# EAGLE design labwiz-module_full_breakout (EAGLE 6.5.0)

## Sheet 1 of 2
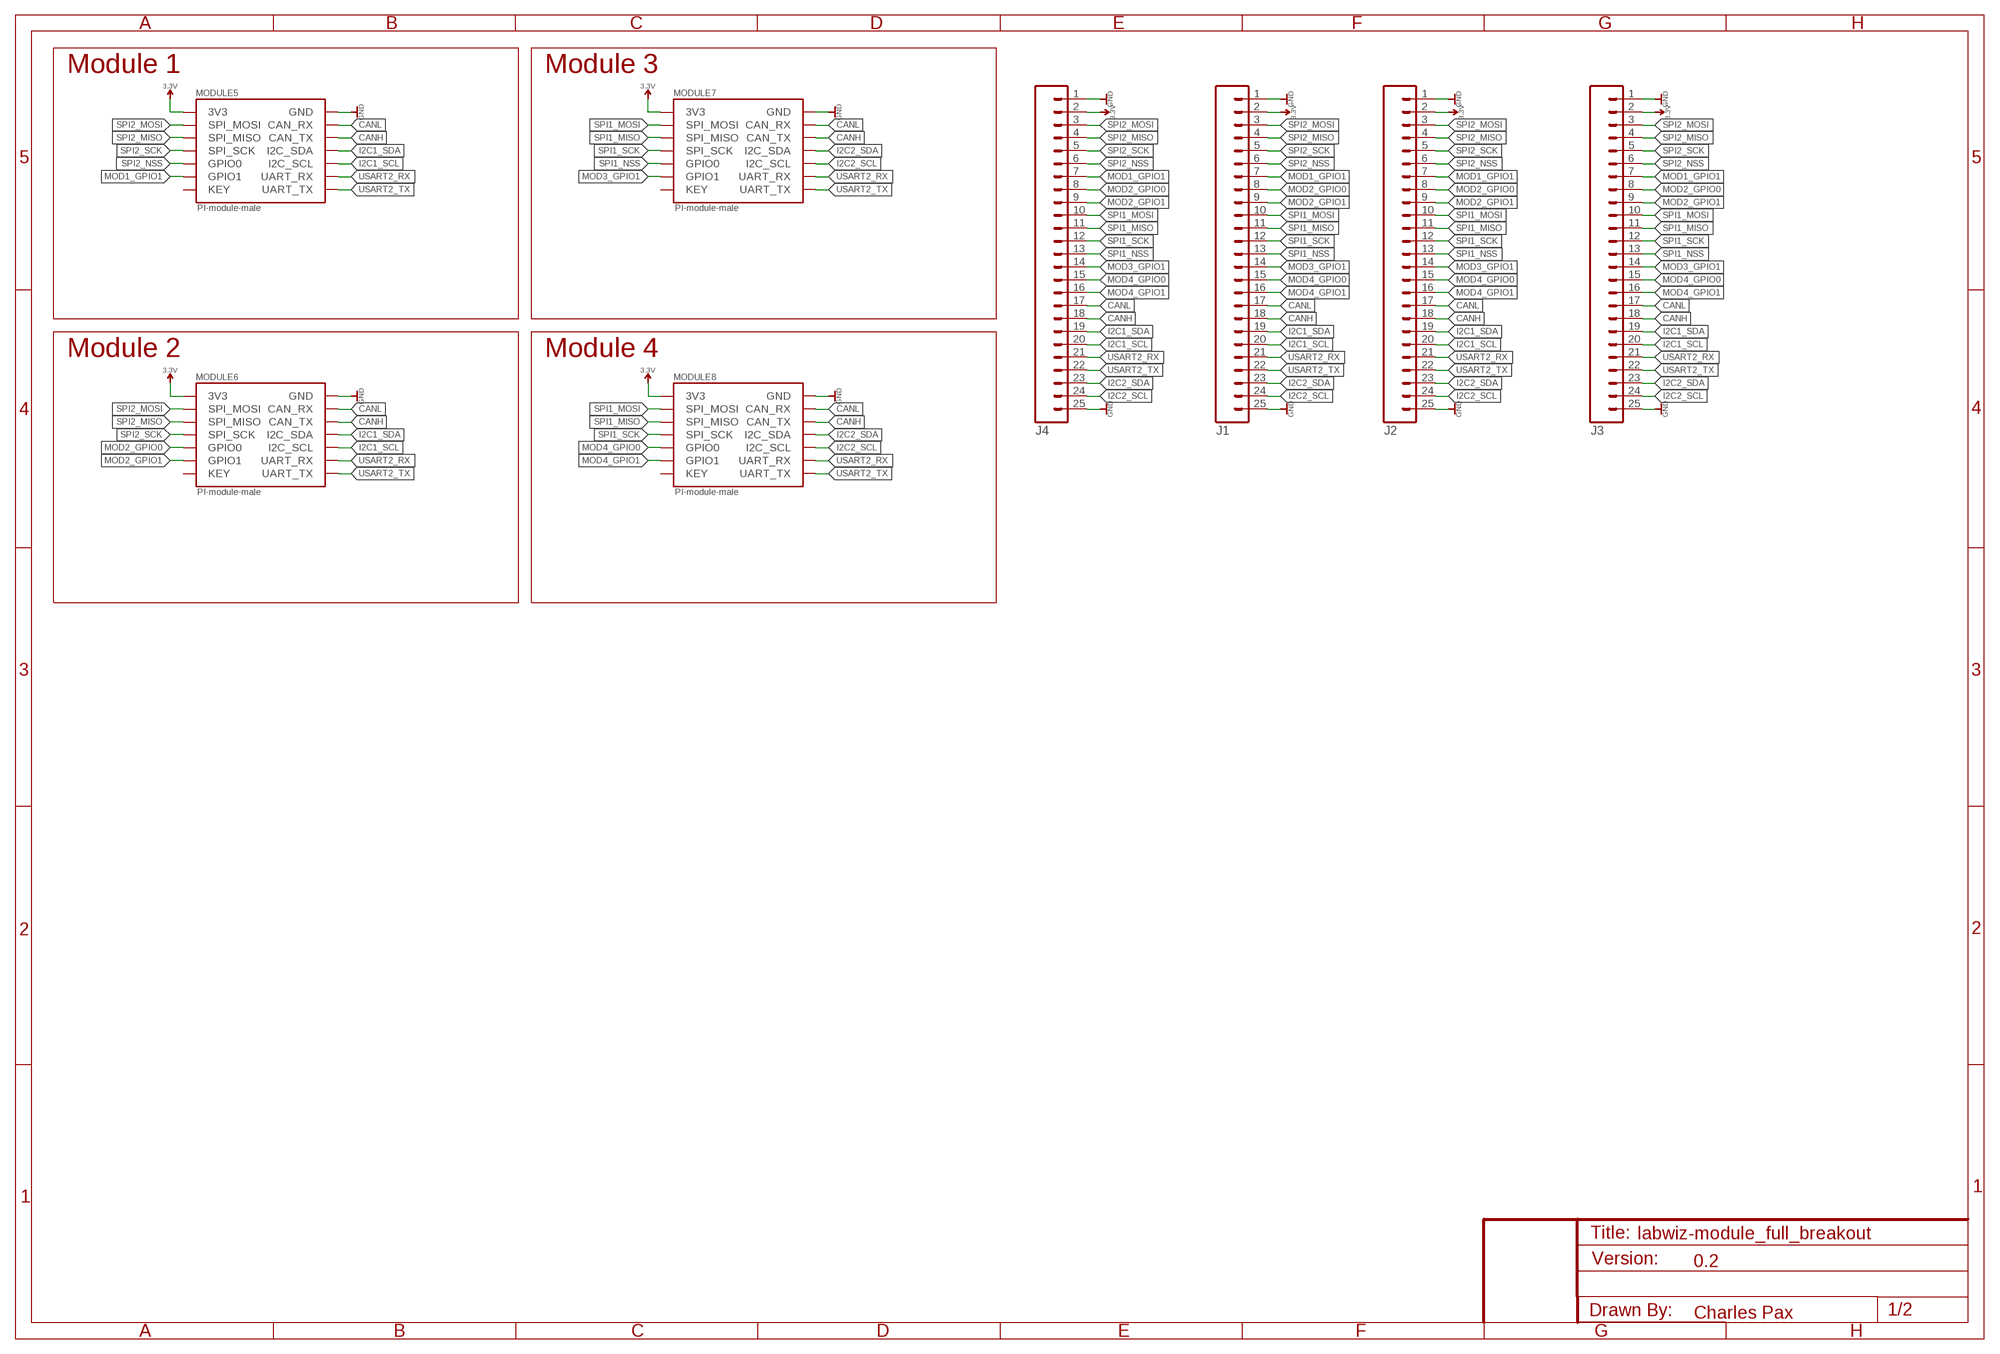
[diagram p0: schematic, sheet 1]

### Parts
J1  M25PTH  [1X25]
J2  M25PTH  [1X25]
J3  M25PTH  [1X25]
J4  M25PTH  [1X25]
MODULE5  PI-module-male  PAX_MODULE_EDGE_MALE_MODULE  [M07X2_2MM_EDGE]
MODULE6  PI-module-male  PAX_MODULE_EDGE_MALE_MODULE  [M07X2_2MM_EDGE]
MODULE7  PI-module-male  PAX_MODULE_EDGE_MALE_MODULE  [M07X2_2MM_EDGE]
MODULE8  PI-module-male  PAX_MODULE_EDGE_MALE_MODULE  [M07X2_2MM_EDGE]

### Nets
3.3V: J1.2 J2.2 J3.2 J4.2 MODULE5.P$13(3V3) MODULE6.P$13(3V3) MODULE7.P$13(3V3) MODULE8.P$13(3V3)
CANH: J1.18 J2.18 J3.18 J4.18 MODULE5.P$10(CAN_TX) MODULE6.P$10(CAN_TX) MODULE7.P$10(CAN_TX) MODULE8.P$10(CAN_TX)
CANL: J1.17 J2.17 J3.17 J4.17 MODULE5.P$12(CAN_RX) MODULE6.P$12(CAN_RX) MODULE7.P$12(CAN_RX) MODULE8.P$12(CAN_RX)
GND: J1.1 J1.25 J2.1 J2.25 J3.1 J3.25 J4.1 J4.25 MODULE5.P$14(GND) MODULE6.P$14(GND) MODULE7.P$14(GND) MODULE8.P$14(GND)
I2C1_SCL: J1.20 J2.20 J3.20 J4.20 MODULE5.P$6(I2C_SCL) MODULE6.P$6(I2C_SCL)
I2C1_SDA: J1.19 J2.19 J3.19 J4.19 MODULE5.P$8(I2C_SDA) MODULE6.P$8(I2C_SDA)
I2C2_SCL: J1.24 J2.24 J3.24 J4.24 MODULE7.P$6(I2C_SCL) MODULE8.P$6(I2C_SCL)
I2C2_SDA: J1.23 J2.23 J3.23 J4.23 MODULE7.P$8(I2C_SDA) MODULE8.P$8(I2C_SDA)
MOD1_GPIO1: J1.7 J2.7 J3.7 J4.7 MODULE5.P$3(GPIO1)
MOD2_GPIO0: J1.8 J2.8 J3.8 J4.8 MODULE6.P$5(GPIO0)
MOD2_GPIO1: J1.9 J2.9 J3.9 J4.9 MODULE6.P$3(GPIO1)
MOD3_GPIO1: J1.14 J2.14 J3.14 J4.14 MODULE7.P$3(GPIO1)
MOD4_GPIO0: J1.15 J2.15 J3.15 J4.15 MODULE8.P$5(GPIO0)
MOD4_GPIO1: J1.16 J2.16 J3.16 J4.16 MODULE8.P$3(GPIO1)
SPI1_MISO: J1.11 J2.11 J3.11 J4.11 MODULE7.P$9(SPI_MISO) MODULE8.P$9(SPI_MISO)
SPI1_MOSI: J1.10 J2.10 J3.10 J4.10 MODULE7.P$11(SPI_MOSI) MODULE8.P$11(SPI_MOSI)
SPI1_NSS: J1.13 J2.13 J3.13 J4.13 MODULE7.P$5(GPIO0)
SPI1_SCK: J1.12 J2.12 J3.12 J4.12 MODULE7.P$7(SPI_SCK) MODULE8.P$7(SPI_SCK)
SPI2_MISO: J1.4 J2.4 J3.4 J4.4 MODULE5.P$9(SPI_MISO) MODULE6.P$9(SPI_MISO)
SPI2_MOSI: J1.3 J2.3 J3.3 J4.3 MODULE5.P$11(SPI_MOSI) MODULE6.P$11(SPI_MOSI)
SPI2_NSS: J1.6 J2.6 J3.6 J4.6 MODULE5.P$5(GPIO0)
SPI2_SCK: J1.5 J2.5 J3.5 J4.5 MODULE5.P$7(SPI_SCK) MODULE6.P$7(SPI_SCK)
USART2_RX: J1.21 J2.21 J3.21 J4.21 MODULE5.P$4(UART_RX) MODULE6.P$4(UART_RX) MODULE7.P$4(UART_RX) MODULE8.P$4(UART_RX)
USART2_TX: J1.22 J2.22 J3.22 J4.22 MODULE5.P$2(UART_TX) MODULE6.P$2(UART_TX) MODULE7.P$2(UART_TX) MODULE8.P$2(UART_TX)
Unconnected: MODULE5.P$1(KEY) MODULE6.P$1(KEY) MODULE7.P$1(KEY) MODULE8.P$1(KEY)

### Notes on the sheet
- Module 1 | Module 3
- Module 2 | Module 4
- 0.2
- Charles Pax

## Sheet 2 of 2

## Library data of the parts
J1-J4 = SparkFun-Connectors:M25: 1x25 .1" header
MODULE5-MODULE8 = PaxInstruments-Connectors:PAX_MODULE; MF: Pax Instruments; MPN: PIxxxx

## Net classes
0 Digital signal: width 0.1 mm, drill 0.2 mm, clearance 0.15 mm
1 3.3V power: width 0.1 mm, drill 0.2 mm, clearance 0.15 mm
2 RTC battery: width 0.1 mm, drill 0.2 mm, clearance 0.15 mm
3 5V power: width 0.1 mm, drill 0.2 mm, clearance 0.15 mm
4 Analog signal: width 0.1 mm, drill 0.2 mm, clearance 0.15 mm
5 GND: width 0.1 mm, drill 0.2 mm, clearance 0.15 mm

## Board
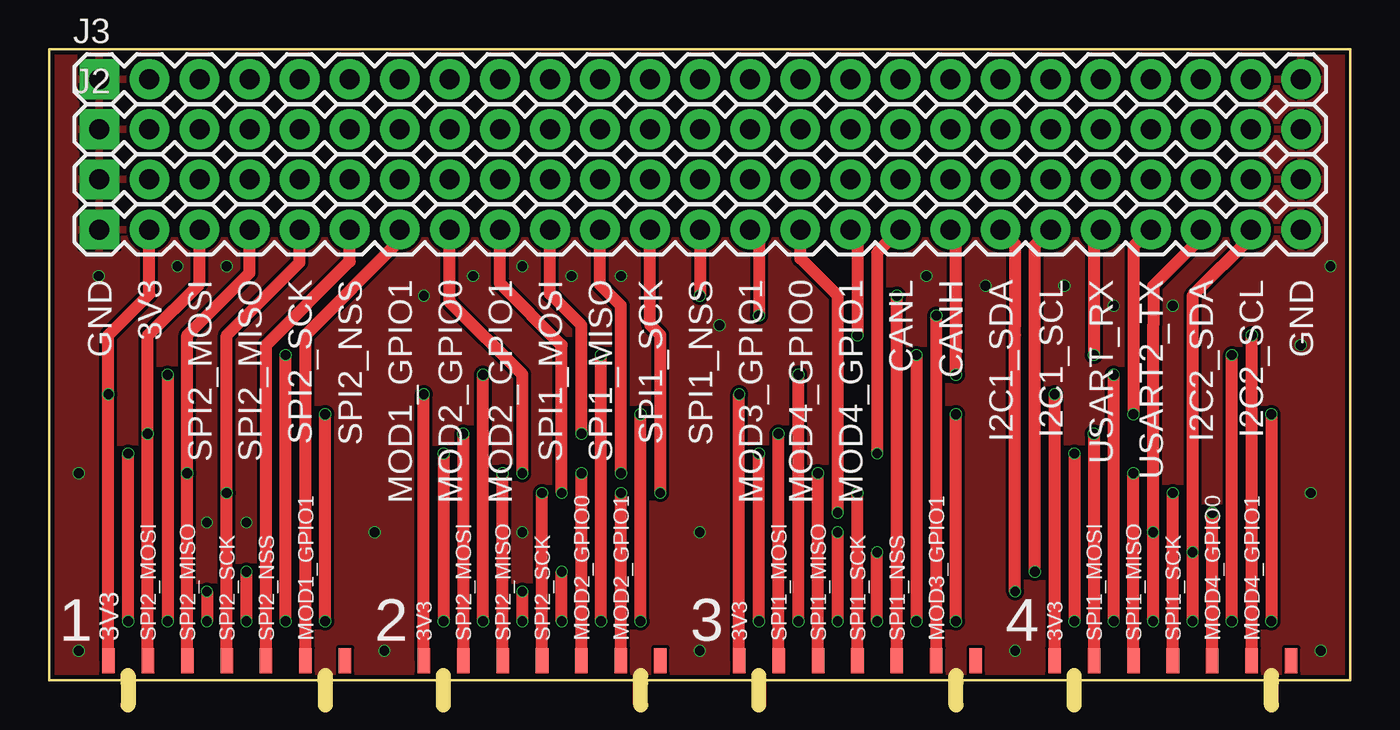
[diagram p1: board, top side]
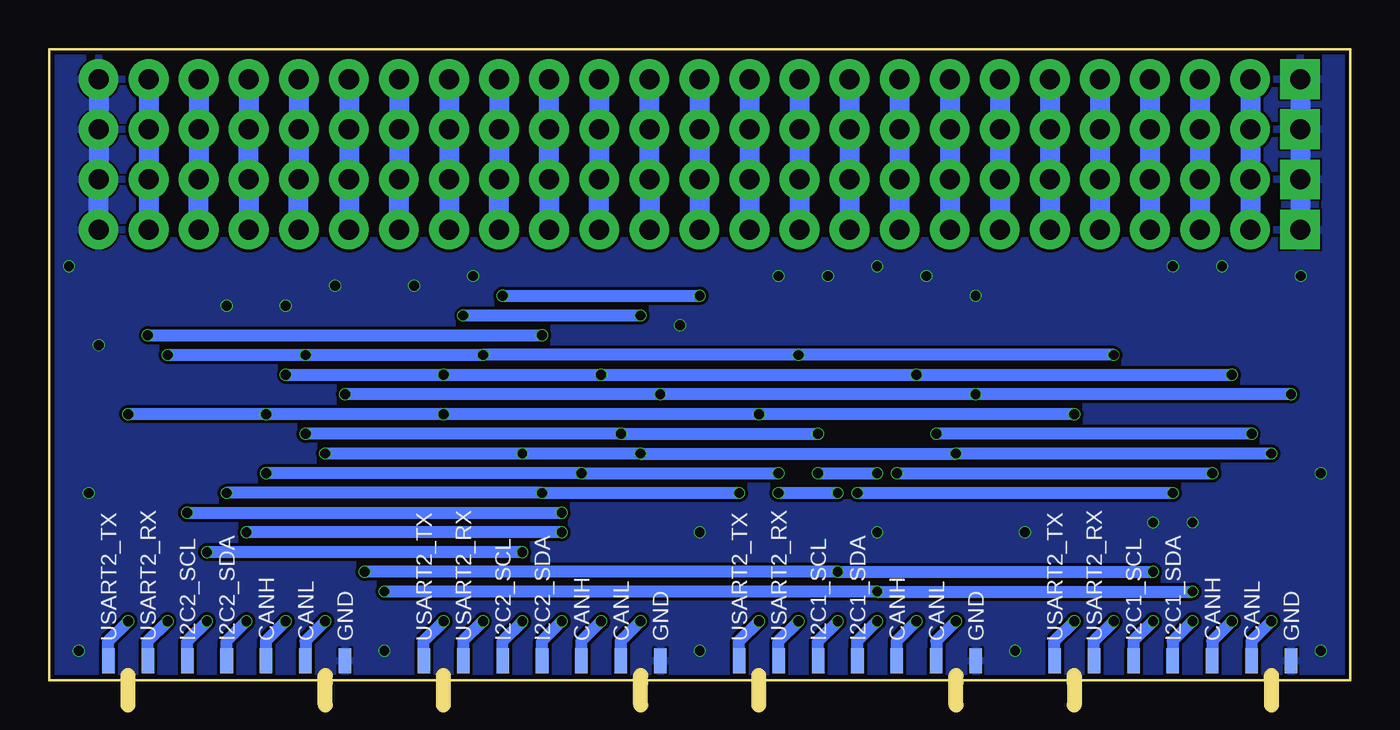
[diagram p2: board, bottom side, seen from below]

Size 66 x 32 mm. Coordinates in mm from the lower left corner, seen from the top.
Outline: 0,32 0,0 66,0 66,32 0,32
Copper layers (1*2+15*16): Top 0.017mm / dielectric 0.5mm / GND 0.017mm / dielectric 0.075mm / 3.3V 0.017mm / dielectric 0.5mm / Bottom 0.017mm
Design rules "PaxInstrument-T400 *": minimum track width 0.1mm, minimum drill 0.2mm, track to track 0.075mm, track to pad 0.075mm, pad to pad 0.075mm, via to via 0.075mm, smd to smd 0.075mm, copper to edge 0.2mm, drill to drill 0.2mm, minimum pad ring 0.5mm, minimum via ring 0.05mm, stop-mask expansion 0.01mm, vias tented up to drill 0.25mm, thermal gap 0.1mm
Milling: 8 lines

### Footprints (pad centres in the part's own frame; a part is rotated, then mirrored left to right if it is on the bottom)
1X25 = drill 1.016 pad 1.88 square: 1 0,0 | drill 1.016 pad 1.88: 2 2.54,0; 3 5.08,0; 4 7.62,0; 5 10.16,0; 6 12.7,0; 7 15.24,0; 8 17.78,0; 9 20.32,0; 10 22.86,0; 11 25.4,0; 12 27.94,0; 13 30.48,0; 14 33.02,0; 15 35.56,0; 16 38.1,0; 17 40.64,0; 18 43.18,0; 19 45.72,0; 20 48.26,0; 21 50.8,0; 22 53.34,0; 23 55.88,0; 24 58.42,0; 25 60.96,0
M07X2_2MM_EDGE = smd 0.635 x 1.27: P$1 0,0; P$3 2,0; P$5 4,0; P$7 6,0; P$9 8,0; P$11 10,0; P$13 12,0 | smd 0.635 x 1.27 bottom: P$2 0,0; P$4 2,0; P$6 4,0; P$8 6,0; P$10 8,0; P$12 10,0; P$14 12,0

### Placement (x,y rotation side)
J1  2.54,25.4 0 top
J2  2.54,27.94 0 top
J3  2.54,30.48 0 top
J4  2.54,22.86 0 top
MODULE5  15,1 180 top
MODULE6  31,1 180 top
MODULE7  47,1 180 top
MODULE8  63,1 180 top

### Tracks (layer width: path | path; a pad name or v marks a point on that pad's centre or on a via)
3.3V  (via drill 0.5)
  Top 0.61: MODULE5.P$13 v3,14.5 3,17.5 5.08,19.58 J4.2 | v51,14.5 MODULE8.P$13 | MODULE7.P$13 v35,14.5 | MODULE6.P$13 v19,14.5
  Bottom 0.61: v3,14.5 v19,14.5 v35,14.5 v51,14.5
  Bottom 1.016: J4.2 J1.2 J2.2 J3.2
CANH  (via drill 0.5)
  Top 0.61: v22,3 v22,15.5 | v6,15.5 v6,3 | v38,3 v38,15.5 | v54,3 v54,15.5 | v46,15.5 46,22.58 J4.18
  Bottom 0.61: MODULE6.P$10 23,2 v22,3 | v6,15.5 v22,15.5 v38,15.5 v46,15.5 v54,15.5 | v6,3 7,2 MODULE5.P$10 | MODULE7.P$10 39,2 v38,3 | MODULE8.P$10 55,2 v54,3
  Bottom 1.016: J4.18 J1.18 J2.18 J3.18
CANL  (via drill 0.5)
  Top 0.61: v52,11.5 v52,3 | v4,3 v4,11.5 | v20,11.5 v20,3 | v36,3 v36,11.5 | v42,11.5 42,21.68 J4.17
  Bottom 0.61: MODULE7.P$12 37,2 v36,3 | v52,11.5 v42,11.5 v36,11.5 v20,11.5 v4,11.5 | v52,3 53,2 MODULE8.P$12 | MODULE5.P$12 5,2 v4,3 | v20,3 21,2 MODULE6.P$12
  Bottom 1.016: J4.17 J1.17 J2.17 J3.17
GND  (via drill 0.5)
  Bottom 1.016: J4.25 J1.25 J2.25 J3.25 | J3.1 J2.1 J1.1 J4.1
  other vias: 2.5,20.5 1.5,1.5 17,1.5 33,1.5 49,1.5 64.5,1.5 65,21 57,19 54,19 51.5,20 47.5,20 44.5,20.5 34,18 33,7.5 29,20.5 24,7.5 19,19.5 10,8 8,8 9,21 6.5,21 16.5,7.5 24,21 26.5,20.5 1.5,10.5 64,9.5 63.5,17 21.5,20.5
  pour Bottom: 0,32 0,0 66,0 66,32
  pour Top: 0,32 0,0 66,0 66,32
I2C1_SCL  (via drill 0.5)
  Top 0.61: v26,3 v26,5.5 | v10,5.5 v10,3 | v50,5.5 50,22.06 J4.20
  Bottom 0.61: MODULE6.P$6 27,2 v26,3 | v10,5.5 v26,5.5 v50,5.5 | v10,3 11,2 MODULE5.P$6
  Bottom 1.016: J4.20 J1.20 J2.20 J3.20
I2C1_SDA  (via drill 0.5)
  Top 0.61: v24,3 v24,4.5 | v8,4.5 v8,3 | v49,4.5 49,17.5 49,18 49,22.12 J4.19
  Bottom 0.61: MODULE6.P$8 25,2 v24,3 | v8,4.5 v24,4.5 v49,4.5 | v8,3 9,2 MODULE5.P$8
  Bottom 1.016: J4.19 J1.19 J2.19 J3.19
I2C2_SCL  (via drill 0.5)
  Top 0.61: v42,3 v42,6.5 | v58,3 v58,6.5 58,19.5 61,22.5 61,22.82 J4.24
  Bottom 0.61: MODULE8.P$6 59,2 v58,3 | MODULE7.P$6 43,2 v42,3 | v42,6.5 v58,6.5
  Bottom 1.016: J4.24 J1.24 J2.24 J3.24
I2C2_SDA  (via drill 0.5)
  Top 0.61: v56,3 v56,7.5 56,17 56,18 56,20 58.5,22.5 58.5,22.78 J4.23 | v40,3 v40,7.5
  Bottom 0.61: MODULE8.P$8 57,2 v56,3 | MODULE7.P$8 41,2 v40,3 | v40,7.5 v56,7.5
  Bottom 1.016: J4.23 J1.23 J2.23 J3.23
MOD1_GPIO1
  Top 0.61: MODULE5.P$3 13,17.5 17.78,22.28 J4.7
  Bottom 1.016: J4.7 J1.7 J2.7 J3.7
MOD2_GPIO0  (via drill 0.5)
  Top 0.61: MODULE6.P$5 v27,10.5 | v24,10.5 24,15.5 20.32,19.18 J4.8
  Bottom 0.61: v27,10.5 v24,10.5
  Bottom 1.016: J4.8 J1.8 J2.8 J3.8
MOD2_GPIO1  (via drill 0.5)
  Top 0.61: MODULE6.P$3 v29,9.5 | v26,9.5 26,17 22.86,20.14 J4.9
  Bottom 0.61: v29,9.5 v26,9.5
  Bottom 1.016: J4.9 J1.9 J2.9 J3.9
MOD3_GPIO1  (via drill 0.5)
  Top 0.61: MODULE7.P$3 v45,18.5 | J4.14 36,22.42 v36,18.5
  Bottom 0.61: v45,18.5 v36,18.5
  Bottom 1.016: J4.14 J1.14 J2.14 J3.14
MOD4_GPIO0  (via drill 0.5)
  Top 0.61: MODULE8.P$5 v59,8.5 | v40,8.5 40,19.5 38.1,21.4 J4.15
  Bottom 0.61: v59,8.5 v40,8.5
  Bottom 1.016: J4.15 J1.15 J2.15 J3.15
MOD4_GPIO1  (via drill 0.5)
  Top 0.61: MODULE8.P$3 v61,17.5 | J4.16 41,22.5 v41,17.5
  Bottom 0.61: v61,17.5 v41,17.5
  Bottom 1.016: J4.16 J1.16 J2.16 J3.16
SPI1_MISO  (via drill 0.5)
  Top 0.61: MODULE7.P$9 v39,10.5 | MODULE8.P$9 v55,10.5 | v29,10.5 29,19 27.94,20.06 J4.11
  Bottom 0.61: v55,10.5 v39,10.5 v29,10.5
  Bottom 1.016: J4.11 J1.11 J2.11 J3.11
SPI1_MOSI  (via drill 0.5)
  Top 0.61: MODULE7.P$11 v37,12.5 | v53,12.5 MODULE8.P$11 | v27,12.5 27,18 25.4,19.6 J4.10
  Bottom 0.61: v53,12.5 v37,12.5 v27,12.5
  Bottom 1.016: J4.10 J1.10 J2.10 J3.10
SPI1_NSS  (via drill 0.5)
  Top 0.61: MODULE7.P$5 v43,19.5 | J4.13 33,22.84 v33,19.5
  Bottom 0.61: v43,19.5 v33,19.5
  Bottom 1.016: J4.13 J1.13 J2.13 J3.13
SPI1_SCK  (via drill 0.5)
  Top 0.61: MODULE7.P$7 v41,9.5 | MODULE8.P$7 v57,9.5 | v31,9.5 31,17.5 30.48,18.02 J4.12
  Bottom 0.61: v57,9.5 v41,9.5 v31,9.5
  Bottom 1.016: J3.12 J2.12 J1.12 J4.12
SPI2_MISO  (via drill 0.5)
  Top 0.61: MODULE5.P$9 v7,10.5 7,17.5 10.16,20.66 J4.4 | MODULE6.P$9 v23,10.5
  Bottom 0.61: v23,10.5 v7,10.5
  Bottom 1.016: J3.4 J2.4 J1.4 J4.4
SPI2_MOSI  (via drill 0.5)
  Top 0.61: MODULE5.P$11 v5,12.5 5,17.5 7.62,20.12 J4.3 | v21,12.5 MODULE6.P$11
  Bottom 0.61: v5,12.5 v21,12.5
  Bottom 1.016: J4.3 J1.3 J2.3 J3.3
SPI2_NSS
  Top 0.61: MODULE5.P$5 11,17 15.24,21.24 J4.6
  Bottom 1.016: J4.6 J1.6 J2.6 J3.6
SPI2_SCK  (via drill 0.5)
  Top 0.61: MODULE5.P$7 v9,9.5 9,17.5 12.7,21.2 J4.5 | MODULE6.P$7 v25,9.5
  Bottom 0.61: v25,9.5 v9,9.5
  Bottom 1.016: J4.5 J1.5 J2.5 J3.5
USART2_RX  (via drill 0.5)
  Top 0.61: v60,3 v60,16.5 | v44,16.5 v44,3 | v28,3 v28,16.5 | v12,3 v12,16.5 | J4.21 53,22.52 v53,16.5
  Bottom 0.61: MODULE8.P$4 61,2 v60,3 | v60,16.5 v53,16.5 v44,16.5 v28,16.5 v12,16.5 | v44,3 45,2 MODULE7.P$4 | MODULE6.P$4 29,2 v28,3 | MODULE5.P$4 13,2 v12,3
  Bottom 1.016: J4.21 J1.21 J2.21 J3.21
USART2_TX  (via drill 0.5)
  Top 0.61: v14,3 v14,13.5 | v62,13.5 v62,3 | v30,3 v30,13.5 | v46,3 v46,13.5 | J4.22 55,21.98 v55,13.5
  Bottom 0.61: MODULE5.P$2 15,2 v14,3 | MODULE6.P$2 31,2 v30,3 | MODULE8.P$2 63,2 v62,3 | v14,13.5 v30,13.5 v46,13.5 v55,13.5 56.5,13.5 v62,13.5 | MODULE7.P$2 47,2 v46,3
  Bottom 1.016: J4.22 J1.22 J2.22 J3.22

### Text on the board
tPlace: GND | 3V3 | SPI2_MOSI | SPI2_MISO | SPI2_SCK | SPI2_NSS | MOD1_GPIO1 | MOD2_GPIO0 | MOD2_GPIO1 | SPI1_MOSI | SPI1_MISO | SPI1_SCK | SPI1_NSS | MOD3_GPIO1 | MOD4_GPIO0 | MOD4_GPIO1 | CANL | CANH | I2C1_SDA | I2C1_SCL | USART_RX | USART2_TX | I2C2_SDA | I2C2_SCL | GND | 1 | 3V3 | SPI2_MOSI | SPI2_MISO | SPI2_SCK | SPI2_NSS | MOD1_GPIO1 | 2 | 3V3 | SPI2_MOSI | SPI2_MISO | SPI2_SCK | MOD2_GPIO0 | MOD2_GPIO1 | 3 | 3V3 | SPI1_MOSI | SPI1_MISO | SPI1_SCK | SPI1_NSS | MOD3_GPIO1 | 4 | 3V3 | SPI1_MOSI | SPI1_MISO | SPI1_SCK | MOD4_GPIO0 | MOD4_GPIO1
bPlace: GND | CANL | CANH | I2C1_SDA | I2C1_SCL | USART2_RX | USART2_TX | GND | CANL | CANH | I2C1_SDA | I2C1_SCL | USART2_RX | USART2_TX | GND | CANL | CANH | I2C2_SDA | I2C2_SCL | USART2_RX | USART2_TX | GND | CANL | CANH | I2C2_SDA | I2C2_SCL | USART2_RX | USART2_TX